# EAGLE schematic bean (EAGLE 7.5.0)
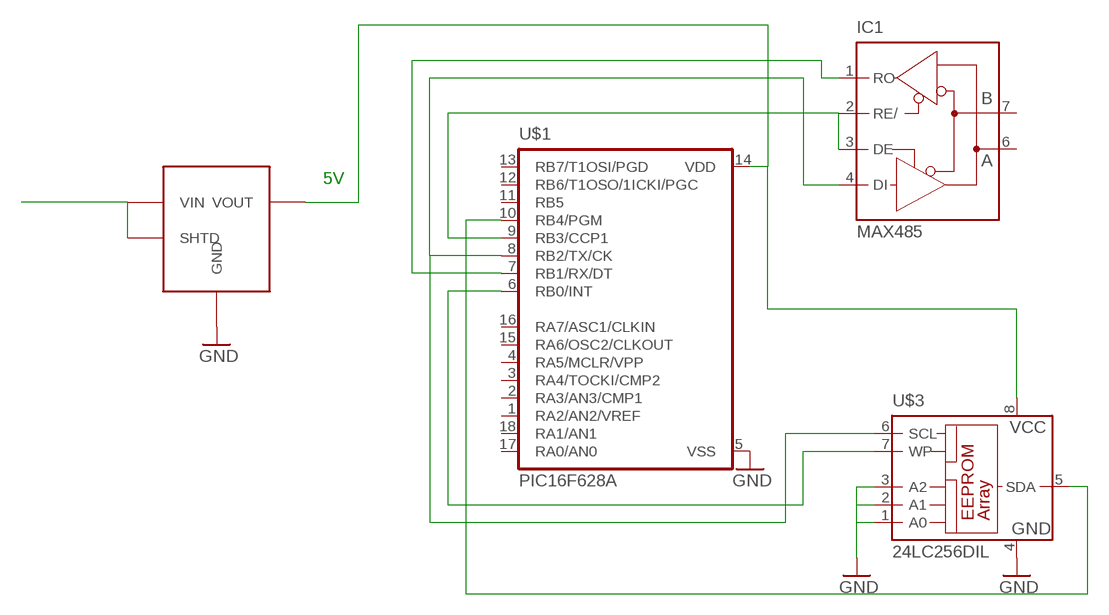
[diagram p0: schematic, sheet 1]

## Parts
IC1  MAX485  [DIL08]
U$1  PIC16F628A  [DIL18]
U$2  POLOLU-2098  [POLOLU-10-13]
U$3  24LC256DIL  [DIL08]

## Nets
GND: U$1.5(VSS) U$2.P$3(GND) U$3.1(A0) U$3.2(A1) U$3.3(A2) U$3.4(GND)
N$1: IC1.4(DI) U$1.8(RB2/TX/CK) U$3.6(SCL)
N$2: IC1.1(RO) U$1.7(RB1/RX/DT)
N$3: IC1.2(RE/) IC1.3(DE) U$1.9(RB3/CCP1)
N$4: U$1.6(RB0/INT) U$3.7(WP)
N$5: U$1.10(RB4/PGM) U$3.5(SDA)
N$6: U$1.14(VDD) U$2.P$4(VOUT) U$3.8(VCC)
N$8: U$2.P$1(SHTD) U$2.P$2(VIN)
Unconnected: IC1.6(A) IC1.7(B) U$1.1(RA2/AN2/VREF) U$1.2(RA3/AN3/CMP1) U$1.3(RA4/TOCKI/CMP2) U$1.4(RA5/MCLR/VPP) U$1.11(RB5) U$1.12(RB6/T1OSO/1ICKI/PGC) U$1.13(RB7/T1OSI/PGD) U$1.15(RA6/OSC2/CLKOUT) U$1.16(RA7/ASC1/CLKIN) U$1.17(RA0/AN0) U$1.18(RA1/AN1)

## Notes on the sheet
- 5V

## Power pins joined to a net without a drawn wire
GND: IC1.5(GND)
VCC: IC1.8(VCC)

## Library data of the parts
IC1 = custom:MAX485: RS485 TRANSEIVER; MPN: MAX481CPA+; OC_FARNELL: unknown; OC_NEWARK: 99K3445
U$1 = custom:PIC16F628A
U$2 = custom:POLOLU-2098: 5V Regulator - Max in 42V
U$3 = custom:24LC256